# Altium project BlueBox-Amp.PrjPcb
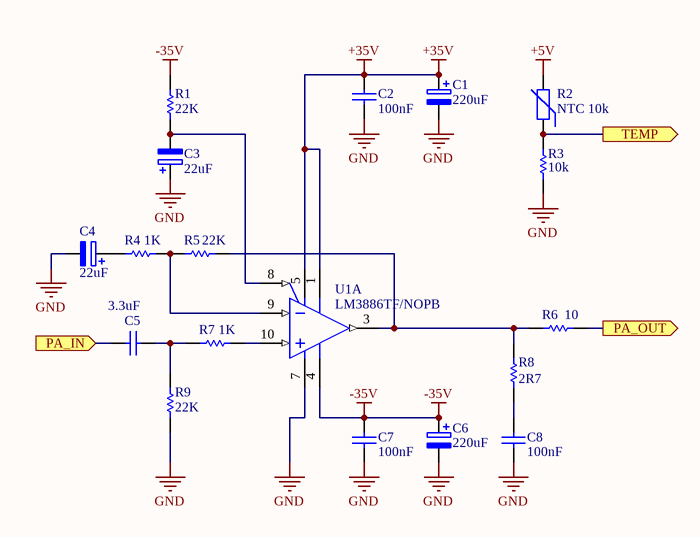
[diagram p0: BlueBox-Amp [PA].SchDoc]
4 sheets, 108 parts. Net scope: flat (ports and power ports of the same name join across sheets).
Board file: BlueBox-Amp.PcbDoc
Sheets:
  BlueBox-Amp [PA].SchDoc
  BlueBox-Amp [CrossOver].SchDoc
  BlueBox-Amp [PowerSuply].SchDoc
  BlueBox-Amp [Speaker Protection].SchDoc

## Sheet BlueBox-Amp [PA].SchDoc
size A

### Parts
C1  value 220uF  [E5-10,5]  (hidden comment: Capacitor Polarized)
C2  value 100nF  [CAPC0603(1608)100_L]  (hidden comment: CAP 100nF 50V 0603(1608))
C3  value 22uF  [EC P2-D5-H11]  (hidden comment: Capacitor Polarized)
C4  value 22uF  [EC P2-D5-H11]  (hidden comment: Capacitor Polarized)
C5  value 3.3uF  [CAPC1210(3225)280_L]  (hidden comment: CAP 3.3uF 50V 1210(3225))
C6  value 220uF  [E5-10,5]  (hidden comment: Capacitor Polarized)
C7  value 100nF  [CAPC0603(1608)100_L]  (hidden comment: CAP 100nF 50V 0603(1608))
C8  value 100nF  [CAPC0603(1608)100_L]  (hidden comment: CAP 100nF 50V 0603(1608))
R1  value 22K  [RESC0603(1608)_L]  (hidden comment: 22K 1% 0603(1608))
R2  NTC 10k  [HDR1X2]
R3  value 10k  [RESC0603(1608)_N]  (hidden comment: 10K 1% 0603(1608))
R4  value 1K  [RESC0603(1608)_M]  (hidden comment: 1K 1% 0603(1608))
R5  value 22K  [RESC0603(1608)_L]  (hidden comment: 22K 1% 0603(1608))
R6  value 10  [RESC2512(6432)_L]  (hidden comment: 10R 5% 2512(6432))
R7  value 1K  [RESC0603(1608)_M]  (hidden comment: 1K 1% 0603(1608))
R8  value 2R7  [RESC2512(6432)_L]  (hidden comment: 2R7 5% 2512(6432))
R9  value 22K  [RESC0603(1608)_L]  (hidden comment: 22K 1% 0603(1608))
U1  LM3886TF/NOPB  [TI-NDA11]  (part A of 2)

### Ports
PA_IN, PA_OUT, TEMP

### Nets
+5V: R2.2
+35V: C1.1 C2.2 U1.1(V+) U1.5(V+)
-35V: C6.1 C7.2 R1.1 U1.4(V-)
GND: C1.2 C2.1 C3.1 C4.2 C6.2 C7.1 C8.2 R3.1 R9.2 U1.7(GND)
NetC3_2: C3.2 R1.2 U1.8(MUTE)
NetC4_1: C4.1 R4.1
NetC5_1: C5.1 ; port PA_IN
NetC5_2: C5.2 R7.1 R9.1
NetC8_1: C8.1 R8.1
NetR2_1: R2.1 R3.2 ; port TEMP
NetR4_2: R4.2 R5.1 U1.9(VIN-)
NetR5_2: R5.2 R6.1 R8.2 U1.3(OUTPUT)
NetR6_2: R6.2 ; port PA_OUT
NetR7_2: R7.2 U1.10(VIN+)

### Library data of the parts
C1 C3 C4 C6 = Capacitor Polarized: Polarized Capacitor
C2 C7 C8 = CMP-1035-02591-1: CAP 100nF 50V ±5% 0603 (1608 Metric) Thickness 1mm SMD; Case-Metric: 1608; Case-EIA: 0603; Rated Voltage: 50 V; Max Thickness: 1 mm; Tolerance: ±5%; Technology: SMT
C5 = CMP-1038-02126-1: CAP 3.3uF 50V ±10% 1210 (3225 Metric) Thickness 2.8mm SMD; Case-Metric: 3225; Case-EIA: 1210; Technology: SMT; Max Thickness: 2.8 mm; Rated Voltage: 50 V; Tolerance: ±10%
R1 R5 R9 = CMP-1012-00659-1: 22K 0.1W 1% 0603 (1608 Metric)  SMD; Case-EIA: 0603; Case-Metric: 1608; Technology: SMT; Power: 0.1 W; Tolerance: 1 %
R2 = NTCALUG02A103F: Thermistors - NTC 10k; Manufacturer: Vishay / BC Components; Resistance: 10 kOhms; Tolerance: 1 %; Value: *; Manufacturer Part Number: NTCALUG02A103F; RoHS: RoHS Compliant By Exemption; Category: Thermistors - NTC; Dimensions: 8.5 mm Dia. x 16.8 mm L x 0.8 mm H; Operating Temperature Range: - 55 C to + 125 C; Packaging: Bulk; Series: NTCALUGxxA; Termination Style: Wire; Type: NTC; Brand: Vishay / BC Components; Standard Pack Qty: 500; RoHS - Mouser: E; Minimum Order Quantity: 1; Reeling: False; ComponentLink1URL: http://www.mouser.com/ds/2/427/23810294-105180.pdf; ComponentLink1Description: http://www.mouser.com/ds/2/427/23810294-105180.pdf; Supplier 1: Mouser; Supplier Part Number 1: 594-NTCALUG02A103F; Stock 1: 9996; Pricing 1: 1=1.66, 10=1.17, 50=1.09, 100=0.970, 200=0.943, 500=0.906, 1000=0.860, 2000=0.849 (AUD)
R3 = CMP-1012-00623-1: 10K 0.1W 1% 0603 (1608 Metric)  SMD; Case-EIA: 0603; Case-Metric: 1608; Power: 0.1 W; Tolerance: 1 %; Technology: SMT
R4 R7 = CMP-1012-00510-1: 1K 0.1W 1% 0603 (1608 Metric)  SMD; Case-Metric: 1608; Case-EIA: 0603; Technology: SMT; Tolerance: 1 %; Power: 0.1 W
R6 = CMP-1018-00026-1: 10R 1W 5% 2512 (6432 Metric)  SMD; Case-EIA: 2512; Case-Metric: 6432; Power: 1 W; Technology: SMT; Tolerance: 5 %
R8 = CMP-1018-00012-1: 2R7 1W 5% 2512 (6432 Metric)  SMD; Case-EIA: 2512; Case-Metric: 6432; Tolerance: 5 %; Technology: SMT; Power: 1 W
U1 = CMP-0994-00114-1: High-Performance 68 W Audio Power Amplifier with Mute, 0 to 70 degC, 11-pin FM (NDA11), Pb-Free (RoHS Exempt); Manufacturer: Texas Instruments; Input Type: Analog; SubFamily: Mid/High-Power Amplifier; PackageVersion: Rev. D, 02/2013; PartNumber: LM3886TF/NOPB; DatasheetVersion: SNAS091C; Eco-Plan: Pb-Free (RoHS Exempt); Mounting Technology: Through Hole; ComponentLink3URL: http://www.ti.com/lit/ml/mmsf015/mmsf015.pdf; ComponentLink1Description: Manufacturer URL; PackageDescription: 11-Pin Metal Flange Mount, Body 20.02 x 4.5 mm, Pitch 1.7 mm; ComponentLink1URL: http://www.ti.com/; ComponentLink2URL: http://www.ti.com/general/docs/lit/getliterature.tsp?genericPartNumber=LM3886&fileType=pdf; ComponentLink3Description: Package Specification; ComponentLink2Description: Datasheet; PackageReference: NDA11; PartId: 1

## Sheet BlueBox-Amp [CrossOver].SchDoc
size A
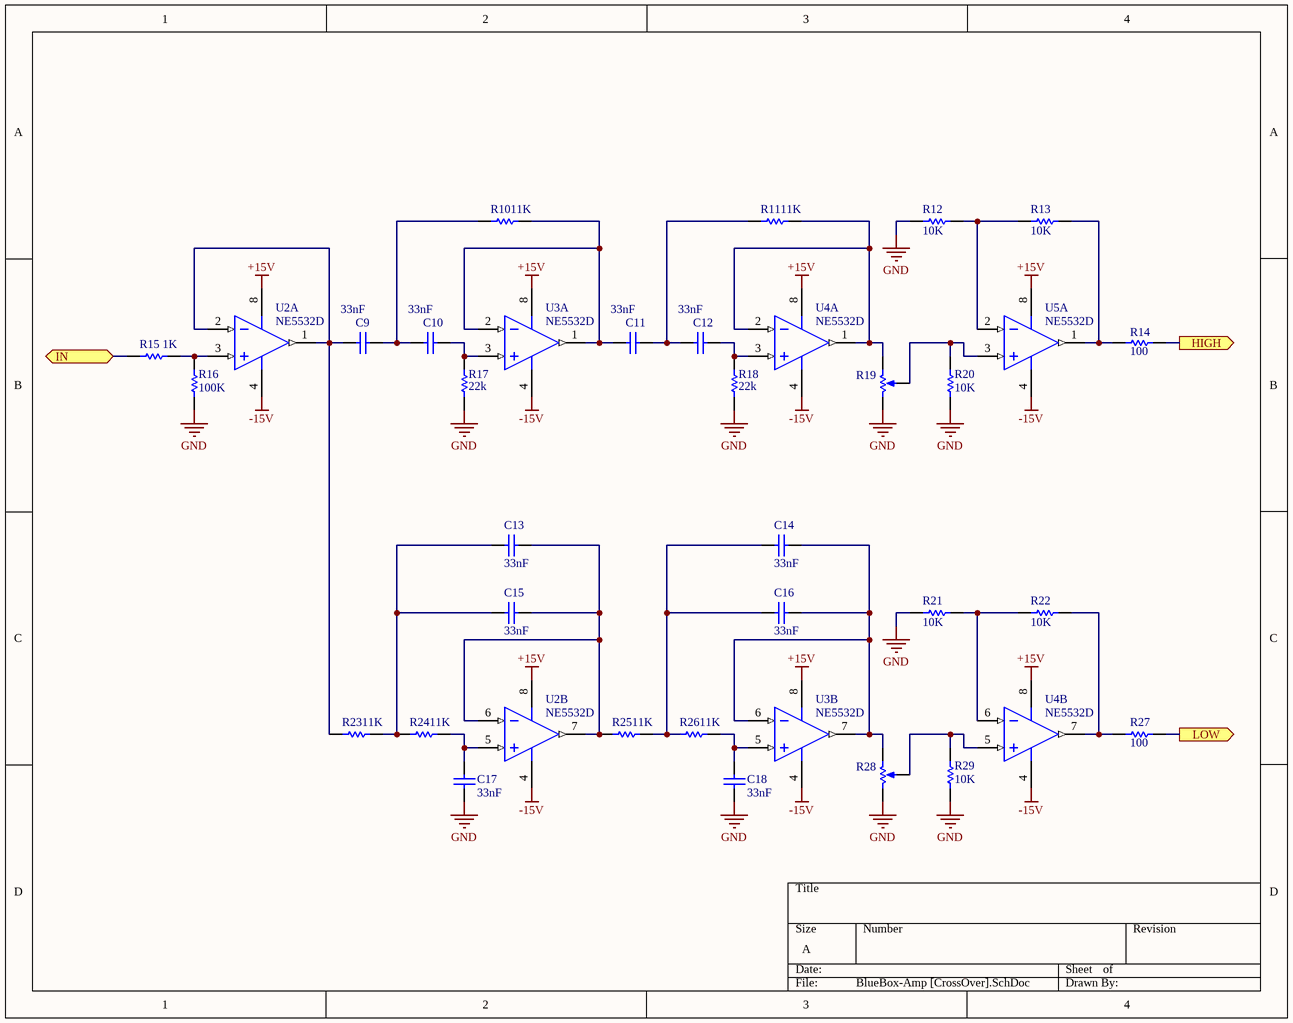
[diagram p1: BlueBox-Amp [CrossOver].SchDoc]

### Parts
C9  value 33nF  [CAPC0603(1608)100_N]  (hidden comment: CAP 33nF 50V 0603(1608))
C10  value 33nF  [CAPC0603(1608)100_N]  (hidden comment: CAP 33nF 50V 0603(1608))
C11  value 33nF  [CAPC0603(1608)100_N]  (hidden comment: CAP 33nF 50V 0603(1608))
C12  value 33nF  [CAPC0603(1608)100_N]  (hidden comment: CAP 33nF 50V 0603(1608))
C13  value 33nF  [CAPC0603(1608)100_N]  (hidden comment: CAP 33nF 50V 0603(1608))
C14  value 33nF  [CAPC0603(1608)100_N]  (hidden comment: CAP 33nF 50V 0603(1608))
C15  value 33nF  [CAPC0603(1608)100_N]  (hidden comment: CAP 33nF 50V 0603(1608))
C16  value 33nF  [CAPC0603(1608)100_N]  (hidden comment: CAP 33nF 50V 0603(1608))
C17  value 33nF  [CAPC0603(1608)100_N]  (hidden comment: CAP 33nF 50V 0603(1608))
C18  value 33nF  [CAPC0603(1608)100_N]  (hidden comment: CAP 33nF 50V 0603(1608))
R10  value 11K  [RESC0603(1608)_M]  (hidden comment: 11K 1% 0603(1608))
R11  value 11K  [RESC0603(1608)_M]  (hidden comment: 11K 1% 0603(1608))
R12  value 10K  [RESC0603(1608)_N]  (hidden comment: 10K 1% 0603(1608))
R13  value 10K  [RESC0603(1608)_N]  (hidden comment: 10K 1% 0603(1608))
R14  value 100  [RESC0603(1608)_M]  (hidden comment: 100R 1% 0603(1608))
R15  value 1K  [RESC0603(1608)_M]  (hidden comment: 1K 1% 0603(1608))
R16  value 100K  [RESC0603(1608)_N]  (hidden comment: 100K 1% 0603(1608))
R17  value 22k  [RESC0603(1608)_L]  (hidden comment: 22K 1% 0603(1608))
R18  value 22k  [RESC0603(1608)_L]  (hidden comment: 22K 1% 0603(1608))
R19  3266W-1-104LF  [BOUR-3266W-3_V]  (value not drawn)
R20  value 10K  [RESC0603(1608)_N]  (hidden comment: 10K 1% 0603(1608))
R21  value 10K  [RESC0603(1608)_N]  (hidden comment: 10K 1% 0603(1608))
R22  value 10K  [RESC0603(1608)_N]  (hidden comment: 10K 1% 0603(1608))
R23  value 11K  [RESC0603(1608)_M]  (hidden comment: 11K 1% 0603(1608))
R24  value 11K  [RESC0603(1608)_M]  (hidden comment: 11K 1% 0603(1608))
R25  value 11K  [RESC0603(1608)_M]  (hidden comment: 11K 1% 0603(1608))
R26  value 11K  [RESC0603(1608)_M]  (hidden comment: 11K 1% 0603(1608))
R27  value 100  [RESC0603(1608)_M]  (hidden comment: 100R 1% 0603(1608))
R28  3266W-1-104LF  [BOUR-3266W-3_V]  (value not drawn)
R29  value 10K  [RESC0603(1608)_N]  (hidden comment: 10K 1% 0603(1608))
U2  NE5532D  [TI-D8_M]  (parts A,B of 2)
U3  NE5532D  [TI-D8_M]  (parts A,B of 2)
U4  NE5532D  [TI-D8_M]  (parts A,B of 2)
U5  NE5532D  [TI-D8_M]  (part A of 2)

### Ports
HIGH, IN, LOW

### Nets
+15V: U2.8(VCC+) U3.8(VCC+) U4.8(VCC+) U5.8(VCC+)
-15V: U2.4(VCC-) U3.4(VCC-) U4.4(VCC-) U5.4(VCC-)
GND: C17.1 C18.1 R12.1 R16.1 R17.1 R18.1 R19.3(CW) R20.2 R21.1 R28.3(CW) R29.2
NetC9_1: C9.1 R23.1 U2.1(OUT1) U2.2(IN1-)
NetC9_2: C9.2 C10.1 R10.1
NetC10_2: C10.2 R17.2 U3.3(IN1+)
NetC11_1: C11.1 R10.2 U3.1(OUT1) U3.2(IN1-)
NetC11_2: C11.2 C12.1 R11.1
NetC12_2: C12.2 R18.2 U4.3(IN1+)
NetC13_1: C13.1 C15.1 R25.1 U2.6(IN2-) U2.7(OUT2)
NetC13_2: C13.2 C15.2 R23.2 R24.1
NetC14_1: C14.1 C16.1 R28.1(CCW) U3.6(IN2-) U3.7(OUT2)
NetC14_2: C14.2 C16.2 R25.2 R26.1
NetC17_2: C17.2 R24.2 U2.5(IN2+)
NetC18_2: C18.2 R26.2 U3.5(IN2+)
NetR11_2: R11.2 R19.1(CCW) U4.1(OUT1) U4.2(IN1-)
NetR12_2: R12.2 R13.1 U5.2(IN1-)
NetR13_2: R13.2 R14.1 U5.1(OUT1)
NetR14_2: R14.2 ; port HIGH
NetR15_1: R15.1 ; port IN
NetR15_2: R15.2 R16.2 U2.3(IN1+)
NetR19_2: R19.2(WIPER) R20.1 U5.3(IN1+)
NetR21_2: R21.2 R22.1 U4.6(IN2-)
NetR22_2: R22.2 R27.1 U4.7(OUT2)
NetR27_2: R27.2 ; port LOW
NetR28_2: R28.2(WIPER) R29.1 U4.5(IN2+)

### Library data of the parts
C9-C18 = CMP-1035-02468-1: CAP 33nF 50V ±5% 0603 (1608 Metric) Thickness 1mm SMD; Case-EIA: 0603; Case-Metric: 1608; Tolerance: ±5%; Max Thickness: 1 mm; Technology: SMT; Rated Voltage: 50 V
R10 R11 R23-R26 = CMP-1012-00627-1: 11K 0.1W 1% 0603 (1608 Metric)  SMD; Case-Metric: 1608; Case-EIA: 0603; Technology: SMT; Power: 0.1 W; Tolerance: 1 %
R12 R13 R20-R22 R29 = CMP-1012-00623-1: as R3 on sheet BlueBox-Amp [PA]; Power: 0.1 W; Tolerance: 1 %; Technology: SMT
R14 R27 = CMP-1012-00397-1: 100R 0.1W 1% 0603 (1608 Metric)  SMD; Case-EIA: 0603; Case-Metric: 1608; Technology: SMT; Tolerance: 1 %; Power: 0.1 W
R15 = CMP-1012-00510-1: as R4 on sheet BlueBox-Amp [PA]; Technology: SMT; Tolerance: 1 %; Power: 0.1 W
R16 = CMP-1012-00736-1: 100K 0.1W 1% 0603 (1608 Metric)  SMD; Case-Metric: 1608; Case-EIA: 0603; Power: 0.1 W; Tolerance: 1 %; Technology: SMT
R17 R18 = CMP-1012-00659-1: as R1 on sheet BlueBox-Amp [PA]; Technology: SMT; Power: 0.1 W; Tolerance: 1 %
R19 R28 = CMP-0975-00021-1: Square Trimpot Trimming Potentiometer, 100 KOhm, 0.25 W, -55 to 125 degC, 3-Pin THD, RoHS, Tube; Manufacturer: Bourns; Power Rating@70 degC: 0.25 W; Tolerance: +/-10%; ComponentLink2URL: https://www.bourns.com/data/global/pdfs/3266.pdf; ComponentLink3Description: Package Specification; ComponentLink1URL: https://www.bourns.com/; ComponentLink2Description: Datasheet; DatasheetVersion: Apr-14; ComponentLink3URL: https://www.bourns.com/data/global/pdfs/3266.pdf; Mounting Technology: Through Hole; Packing: Tube; PackageDescription: 3-Pin THD, Body 6.35 x 4.31 mm, Pitch 2.54 mm; ComponentLink1Description: Manufacturer URL; Operating Temperature: -55 to 125 degC; PartNumber: 3266W-1-104LF; Resistance: 100 kOhm; RoHS: TRUE
U2-U5 = CMP-0015-00060-1: Dual Low-Noise High-Speed Audio Operational Amplifier, 10 to 30 V, 0 to 70 degC, 8-pin SOIC (D8), Green (RoHS & no Sb/Br); Manufacturer: Texas Instruments; Iq per channel(Max)(mA): 4; Total Supply Voltage(Max)(+5V is 5, +/-5V is 10): 30; Vn at 1kHz(Typ)(nV/rtHz): 5; GBW(Typ)(MHz): 10; IIB(Max)(pA): 800000; Sub Family: General Purpose Amplifier, High Supply Voltage Amplifier (>=30V), Low Noise Amp (<=10nV/rtHz); Number of Channels: 2; CMRR(Min)(dB): 70; Slew Rate(Typ)(V/us): 9; ComponentLink1Description: Manufacturer URL; PackageDescription: 8-Pin Plastic Small Outline, Body 4.9 x 3.9 mm, Pitch 1.27 mm; Code_JEDEC: MS-012; Eco-Plan: Green (RoHS & no Sb/Br); ComponentLink3Description: Package Specification; PackageReference: D8; Total Supply Voltage(Min)(+5V is 5, +/-5V is 10): 10; PackageVersion: 4040047-3/M, 06/2011; ComponentLink2Description: Datasheet; PartNumber: NE5532D; ComponentLink2URL: http://www.ti.com/lit/ds/symlink/ne5532.pdf; Mounting Technology: Surface Mount; Vio (25C)(Max)(mV): 4; DatasheetVersion: SLOS075I; ComponentLink3URL: http://www.ti.com/litv/pdf/msoi002j; ComponentLink1URL: http://www.ti.com/; PartId: 1

## Sheet BlueBox-Amp [PowerSuply].SchDoc
size A
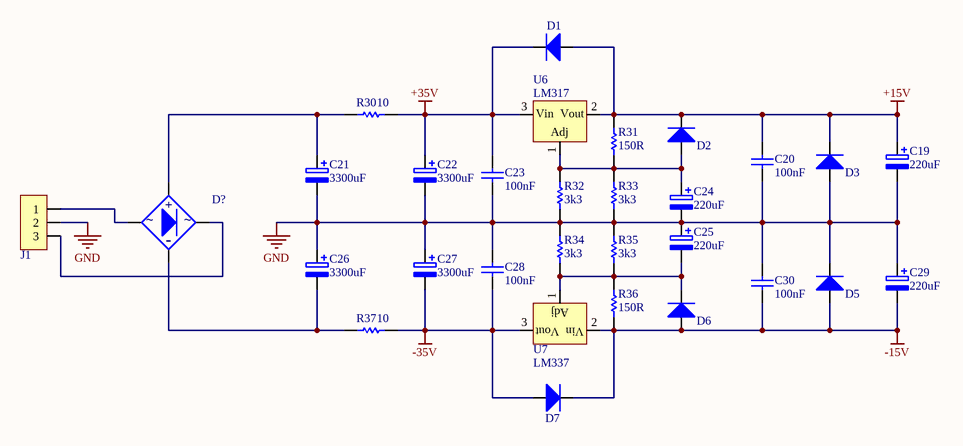
[diagram p2: BlueBox-Amp [PowerSuply].SchDoc]

### Parts
C19  value 220uF  [E5-10,5]  (hidden comment: Capacitor Polarized)
C20  value 100nF  [CAPC0603(1608)100_L]  (hidden comment: CAP 100nF 50V 0603(1608))
C21  value 3300uF  [EC P7.5-D18-H35.5]  (hidden comment: Capacitor Polarized)
C22  value 3300uF  [EC P7.5-D18-H35.5]  (hidden comment: Capacitor Polarized)
C23  value 100nF  [CAPC0603(1608)100_L]  (hidden comment: CAP 100nF 50V 0603(1608))
C24  value 220uF  [E5-10,5]  (hidden comment: Capacitor Polarized)
C25  value 220uF  [E5-10,5]  (hidden comment: Capacitor Polarized)
C26  value 3300uF  [EC P7.5-D18-H35.5]  (hidden comment: Capacitor Polarized)
C27  value 3300uF  [EC P7.5-D18-H35.5]  (hidden comment: Capacitor Polarized)
C28  value 100nF  [CAPC0603(1608)100_L]  (hidden comment: CAP 100nF 50V 0603(1608))
C29  value 220uF  [E5-10,5]  (hidden comment: Capacitor Polarized)
C30  value 100nF  [CAPC0603(1608)100_L]  (hidden comment: CAP 100nF 50V 0603(1608))
D1  STTH1R02A  [SMA]  (value not drawn)
D2  STTH1R02A  [SMA]  (value not drawn)
D3  STTH1R02A  [SMA]  (value not drawn)
D5  STTH1R02A  [SMA]  (value not drawn)
D6  STTH1R02A  [SMA]  (value not drawn)
D7  STTH1R02A  [SMA]  (value not drawn)
D?  KBU1010  [KBU1010]  (value not drawn)
J1  Header 3X1  [HDR1X3]  (value not drawn)
R30  value 10  [RESC2512(6432)_L]  (hidden comment: 10R 5% 2512(6432))
R31  value 150R  [RESC0603(1608)_M]  (hidden comment: 150R 1% 0603(1608))
R32  value 3k3  [RESC0603(1608)_L]  (hidden comment: 3K3 1% 0603(1608))
R33  value 3k3  [RESC0603(1608)_L]  (hidden comment: 3K3 1% 0603(1608))
R34  value 3k3  [RESC0603(1608)_L]  (hidden comment: 3K3 1% 0603(1608))
R35  value 3k3  [RESC0603(1608)_L]  (hidden comment: 3K3 1% 0603(1608))
R36  value 150R  [RESC0603(1608)_M]  (hidden comment: 150R 1% 0603(1608))
R37  value 10  [RESC2512(6432)_L]  (hidden comment: 10R 5% 2512(6432))
U6  LM317  [D2-PAK-3]
U7  LM337  [D2-PAK-3]

### Nets
+15V: C19.1 C20.2 D1.1(A) D2.2(K) D3.2(K) R31.2 U6.2(OUT)
+35V: C22.1 C23.2 D1.2(K) R30.2 U6.3(IN)
-15V: C29.2 C30.1 D5.1(A) D6.1(A) D7.2(K) R36.1 U7.2(IN)
-35V: C27.2 C28.1 D7.1(A) R37.2 U7.3(OUT)
GND: C19.2 C20.1 C21.2 C22.2 C23.1 C24.2 C25.1 C26.1 C27.1 C28.2 C29.1 C30.2 D3.1(A) D5.2(K) J1.2 R32.1 R33.1 R34.2 R35.2
NetC21_1: C21.1 D?.1(+) R30.1
NetC24_1: C24.1 D2.1(A) R31.1 R32.2 R33.2 U6.1(Adj)
NetC25_2: C25.2 D6.2(K) R34.1 R35.1 R36.2 U7.1(Adj)
NetC26_2: C26.2 D?.4(-) R37.1
NetD?_2: D?.2(s1) J1.1
NetD?_3: D?.3(s2) J1.3

### Notes on the sheet
- (in symbol KBU1010) ~
- (in symbol LM317D2TR4G) Vin; Vout
- (in symbol LM337D2TR4G) Vout; Vin

### Library data of the parts
C19 C21 C22 C24-C27 C29 = Capacitor Polarized: Polarized Capacitor
C20 C23 C28 C30 = CMP-1035-02591-1: as C2 on sheet BlueBox-Amp [PA]; Rated Voltage: 50 V; Max Thickness: 1 mm; Tolerance: ±5%; Technology: SMT
D1-D3 D5-D7 = STTH1R02A: Rectifiers Ultrafast recovery Diode; Manufacturer: Taiwan Semiconductor; Manufacturer Part Number: RS2BA; Configuration: Single; Forward Continuous Current: 1.5 A; Max Surge Current: 50 A; Recovery Time: 150 ns; Reverse Voltage: 100 V; Forward Voltage Drop: 1.3 V; Reverse Current IR: 5 uA; Value: *; RoHS: RoHS Compliant By Exemption; Category: Rectifiers; Package / Case: DO-214AC-2; Packaging: Reel; Product: Fast Recovery Rectifiers; Brand: Taiwan Semiconductor; Mounting Style: SMD/SMT; Maximum Operating Temperature: + 150 C; Minimum Operating Temperature: - 55 C; Product Category: Rectifiers - Fast Recovery; Standard Pack Qty: 7500; RoHS - Mouser: E; Minimum Order Quantity: 1; Reeling: True; ComponentLink1URL: http://www.mouser.com/ds/2/395/RS2AA SERIES_G14-523440.pdf; ComponentLink1Description: http://www.mouser.com/ds/2/395/RS2AA SERIES_G14-523440.pdf; Series: STTH1R02; ComponentLink2URL: http://www.mouser.com/ds/2/389/CD00110329-250796.pdf; ComponentLink2Description: http://www.mouser.com/ds/2/389/CD00110329-250796.pdf; Supplier 1: Mouser; Supplier Part Number 1: 821-RS2BA; Stock 1: 0; Pricing 1: 1=0.297, 25=0.267, 100=0.178, 500=0.137, 1000=0.101, 1800=0.091, 3600=0.088, 9000=0.074 (AUD); Supplier 2: Mouser; Supplier Part Number 2: 511-STTH1R02A; Stock 2: 13423; Pricing 2: 1=0.668, 10=0.447, 100=0.249, 1000=0.187, 5000=0.157, 10000=0.146, 25000=0.134, 50000=0.129, 100000=0.123 (AUD)
D? = KBU1010: Manufacturer: Comchip Technology; Manufacturer Part Number: KBU1010-G; Value: DF01S1; Forward Continuous Current: 10 A; Max Surge Current: 240 A; Forward Voltage Drop: 1 V; Maximum Reverse Leakage Current: 10 uA; Maximum RMS Reverse Voltage: 700 V; Peak Reverse Voltage: 1000 V; RoHS: RoHS Compliant; Category: Bridge Rectifiers; Package / Case: KBU; Packaging: Bulk; Series: KBU1010; Brand: Comchip Technology; Mounting Style: Through Hole; Maximum Operating Temperature: + 125 C; Minimum Operating Temperature: - 55 C; Product Category: Comchip Technology; Standard Pack Qty: 2400; RoHS - Mouser: Y; Minimum Order Quantity: 1; Reeling: False; ComponentLink1URL: http://www.mouser.com/ds/2/80/KBU10005-G_KBU1010-G-3822.pdf; ComponentLink1Description: http://www.mouser.com/ds/2/80/KBU10005-G_KBU1010-G-3822.pdf; Supplier 1: Mouser; Supplier Part Number 1: 750-KBU1010-G; Stock 1: 80; Pricing 1: 1=2.49, 10=1.99, 100=1.47, 500=1.35, 1000=0.998, 2500=0.947, 5000=0.927, 10000=0.891 (AUD)
J1 = Header 3X1: Header, 3-Pin, Single row
R30 R37 = CMP-1018-00026-1: as R6 on sheet BlueBox-Amp [PA]; Power: 1 W; Technology: SMT; Tolerance: 5 %
R31 R36 = CMP-1012-00415-1: 150R 0.1W 1% 0603 (1608 Metric)  SMD; Case-Metric: 1608; Case-EIA: 0603; Tolerance: 1 %; Power: 0.1 W; Technology: SMT
R32-R35 = CMP-1012-00567-1: 3K3 0.1W 1% 0603 (1608 Metric)  SMD; Case-Metric: 1608; Case-EIA: 0603; Power: 0.1 W; Tolerance: 1 %; Technology: SMT
U6 = LM317D2TR4G: Linear Voltage Regulators 1.5A ADJ 1.2-37V Positive; Supplier 1: Mouser; Supplier Part Number 1: 863-LM317D2TR4G
U7 = LM337D2TR4G: Linear Voltage Regulators 1.5A -1.2 to -37V ADJ Negative; Supplier 1: Mouser; Supplier Part Number 1: 863-LM337D2TR4G

## Sheet BlueBox-Amp [Speaker Protection].SchDoc
size A
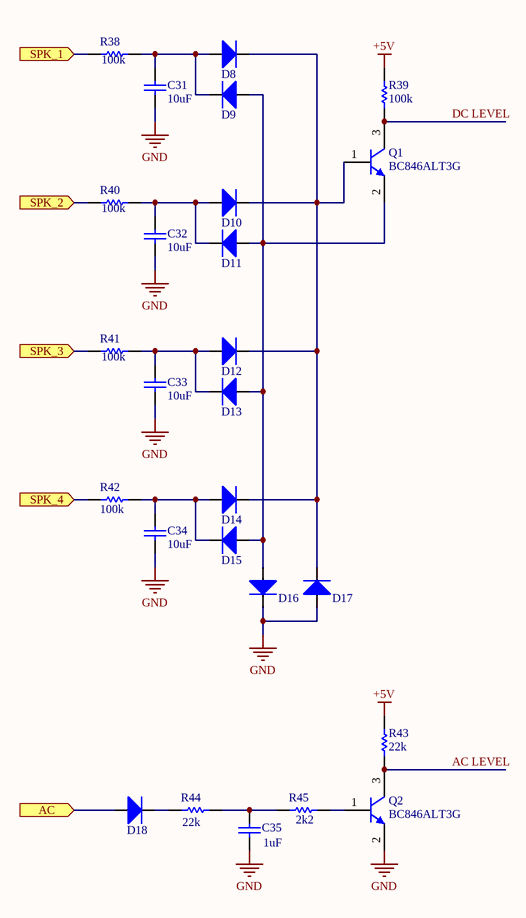
[diagram p3: BlueBox-Amp [Speaker Protection].SchDoc]

### Parts
C31  value 10uF  [CAPC1206(3216)190_M]  (hidden comment: CAP 10uF 50V 1206(3216))
C32  value 10uF  [CAPC1206(3216)190_M]  (hidden comment: CAP 10uF 50V 1206(3216))
C33  value 10uF  [CAPC1206(3216)190_M]  (hidden comment: CAP 10uF 50V 1206(3216))
C34  value 10uF  [CAPC1206(3216)190_M]  (hidden comment: CAP 10uF 50V 1206(3216))
C35  value 1uF  [CAPC0603(1608)100_L]  (hidden comment: CAP 1uF 50V 0603(1608))
D8  1N4148WS  [SOD323]  (value not drawn)
D9  1N4148WS  [SOD323]  (value not drawn)
D10  1N4148WS  [SOD323]  (value not drawn)
D11  1N4148WS  [SOD323]  (value not drawn)
D12  1N4148WS  [SOD323]  (value not drawn)
D13  1N4148WS  [SOD323]  (value not drawn)
D14  1N4148WS  [SOD323]  (value not drawn)
D15  1N4148WS  [SOD323]  (value not drawn)
D16  1N4148WS  [SOD323]  (value not drawn)
D17  1N4148WS  [SOD323]  (value not drawn)
D18  1N4148WS  [SOD323]  (value not drawn)
Q1  BC846ALT3G  [ONSC-SOT-23-3-318-08_V]
Q2  BC846ALT3G  [ONSC-SOT-23-3-318-08_V]
R38  value 100k  [RESC0603(1608)_N]  (hidden comment: 100K 1% 0603(1608))
R39  value 100k  [RESC0603(1608)_N]  (hidden comment: 100K 1% 0603(1608))
R40  value 100k  [RESC0603(1608)_N]  (hidden comment: 100K 1% 0603(1608))
R41  value 100k  [RESC0603(1608)_N]  (hidden comment: 100K 1% 0603(1608))
R42  value 100k  [RESC0603(1608)_N]  (hidden comment: 100K 1% 0603(1608))
R43  value 22k  [RESC0603(1608)_L]  (hidden comment: 22K 1% 0603(1608))
R44  value 22k  [RESC0603(1608)_L]  (hidden comment: 22K 1% 0603(1608))
R45  value 2k2  [RESC0603(1608)_L]  (hidden comment: 2K2 1% 0603(1608))

### Ports
AC, SPK_1, SPK_2, SPK_3, SPK_4

### Nets
+5V: R39.2 R43.2
GND: C31.1 C32.1 C33.1 C34.1 C35.1 D16.2(K) D17.1(A) Q2.2(E)
AC LEVEL: Q2.3(C) R43.1
DC LEVEL: Q1.3(C) R39.1
NetC31_2: C31.2 D8.1(A) D9.2(K) R38.2
NetC32_2: C32.2 D10.1(A) D11.2(K) R40.2
NetC33_2: C33.2 D12.1(A) D13.2(K) R41.2
NetC34_2: C34.2 D14.1(A) D15.2(K) R42.2
NetC35_2: C35.2 R44.2 R45.1
NetD8_2: D8.2(K) D10.2(K) D12.2(K) D14.2(K) D17.2(K) Q1.1(B)
NetD9_1: D9.1(A) D11.1(A) D13.1(A) D15.1(A) D16.1(A) Q1.2(E)
NetD18_1: D18.1(A) ; port AC
NetD18_2: D18.2(K) R44.1
NetQ2_1: Q2.1(B) R45.2
NetR38_1: R38.1 ; port SPK_1
NetR40_1: R40.1 ; port SPK_2
NetR41_1: R41.1 ; port SPK_3
NetR42_1: R42.1 ; port SPK_4

### Library data of the parts
C31-C34 = CMP-1037-04982-1: CAP 10uF 50V ±10% 1206 (3216 Metric) Thickness 1.9mm SMD; Case-EIA: 1206; Case-Metric: 3216; Technology: SMT; Tolerance: ±10%; Max Thickness: 1.9 mm; Rated Voltage: 50 V
C35 = CMP-1035-02745-1: CAP 1uF 50V ±10% 0603 (1608 Metric) Thickness 1mm SMD; Case-EIA: 0603; Case-Metric: 1608; Technology: SMT; Rated Voltage: 50 V; Max Thickness: 1 mm; Tolerance: ±10%
D8-D18 = 1N4148WS: Diode; Mouser: http://www.mouser.com/Semiconductors/Discrete-Semiconductors/Diodes-Rectifiers/Diodes-General-Purpose-Power-Switching/_/N-ax1mp?P=1z0z5meZ1z0xoywZ1z0sou6&Ns=Pricing%7c0
Q1 Q2 = CMP-1048-00778-1: General Purpose Transistor, NPN Silicon, 3-Pin SOT-23, Pb-Free, Tape and Reel; Manufacturer: On Semiconductor; IC Continuous (A): 0.1; fT Min (MHz): 100; Mounting Technology: Surface Mount; ComponentLink3URL: http://www.onsemi.cn/pub_link/Collateral/318-08.PDF; ComponentLink1URL: http://www.onsemi.com/; ComponentLink2Description: Datasheet; PartNumber: BC846ALT3G; PackageDescription: 3-Pin Small Outline Transistor, Body 2.92 x 1.3 mm, Pitch 0.95 mm; PackageVersion: Rev. AP, 11/2009; RoHS: TRUE; PackageReference: SOT-23-3-318-08; Packing: Tape and Reel; DatasheetVersion: Rev. 11; ComponentLink2URL: http://www.onsemi.cn/pub_link/Collateral/BC846ALT1-D.PDF; ComponentLink1Description: Manufacturer URL; Polarity: NPN; ComponentLink3Description: Package Specification
R38-R42 = CMP-1012-00736-1: as R16 on sheet BlueBox-Amp [CrossOver]; Power: 0.1 W; Tolerance: 1 %; Technology: SMT
R43 R44 = CMP-1012-00659-1: as R1 on sheet BlueBox-Amp [PA]; Technology: SMT; Power: 0.1 W; Tolerance: 1 %
R45 = CMP-1012-00546-1: 2K2 0.1W 1% 0603 (1608 Metric)  SMD; Case-EIA: 0603; Case-Metric: 1608; Tolerance: 1 %; Power: 0.1 W; Technology: SMT

## Nets that join several sheets
+5V: BlueBox-Amp [PA] (R2.2), BlueBox-Amp [Speaker Protection] (R39.2 R43.2)
+15V: BlueBox-Amp [CrossOver] (U2.8 U3.8 U4.8 U5.8), BlueBox-Amp [PowerSuply] (7 pins)
+35V: BlueBox-Amp [PA] (C1.1 C2.2 U1.1 U1.5), BlueBox-Amp [PowerSuply] (5 pins)
-15V: BlueBox-Amp [CrossOver] (U2.4 U3.4 U4.4 U5.4), BlueBox-Amp [PowerSuply] (7 pins)
-35V: BlueBox-Amp [PA] (C6.1 C7.2 R1.1 U1.4), BlueBox-Amp [PowerSuply] (5 pins)
GND: BlueBox-Amp [PA] (10 pins), BlueBox-Amp [CrossOver] (11 pins), BlueBox-Amp [PowerSuply] (19 pins), BlueBox-Amp [Speaker Protection] (8 pins)